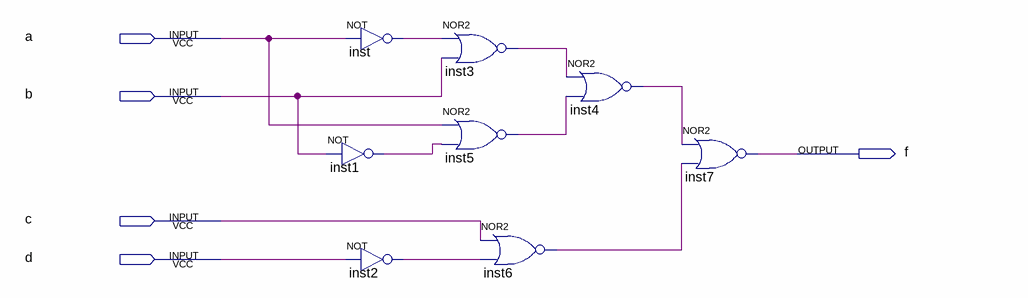
[diagram p0: schematic sheet]
// Quartus schematic logic_01_base.bdf as structural Verilog: 8 symbols, 5 pins
module logic_01_base (
  input  a,
  input  b,
  input  c,
  input  d,
  output f
);

  wire inst1_out, inst2_out, inst3_out, inst4_out, inst5_out, inst6_out, inst_out;

  not inst (inst_out, a);
  not inst1 (inst1_out, b);
  not inst2 (inst2_out, d);
  nor inst3 (inst3_out, inst_out, b);
  nor inst5 (inst5_out, a, inst1_out);
  nor inst6 (inst6_out, c, inst2_out);
  nor inst4 (inst4_out, inst3_out, inst5_out);
  nor inst7 (f, inst4_out, inst6_out);
endmodule
